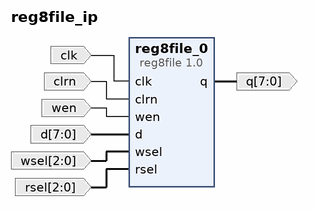
[diagram p0: block diagram of the top level]
# Vivado block design reg8file_ip, xc7a35ticpg236-1L, Vivado 2016.3
create_bd_design reg8file_ip

create_bd_port -dir I -type clk clk
create_bd_port -dir I clrn
create_bd_port -dir I wen
create_bd_port -dir I -from 7 -to 0 d
create_bd_port -dir I -from 2 -to 0 wsel
create_bd_port -dir I -from 2 -to 0 rsel
create_bd_port -dir O -from 7 -to 0 q

create_bd_cell -type ip -vlnv freedom:reg8file_ip:reg8file:1.0 reg8file_0

# ---- connections ----

connect_bd_net [get_bd_ports clk] [get_bd_pins reg8file_0/clk]
connect_bd_net [get_bd_ports clrn] [get_bd_pins reg8file_0/clrn]
connect_bd_net [get_bd_ports wen] [get_bd_pins reg8file_0/wen]
connect_bd_net [get_bd_ports d] [get_bd_pins reg8file_0/d]
connect_bd_net [get_bd_ports wsel] [get_bd_pins reg8file_0/wsel]
connect_bd_net [get_bd_ports rsel] [get_bd_pins reg8file_0/rsel]
connect_bd_net [get_bd_pins reg8file_0/q] [get_bd_ports q]

validate_bd_design
save_bd_design
